# Altium schematic sheet Main_Board.SchDoc
size A4; SheetNumber: 1; SheetTotal: 4
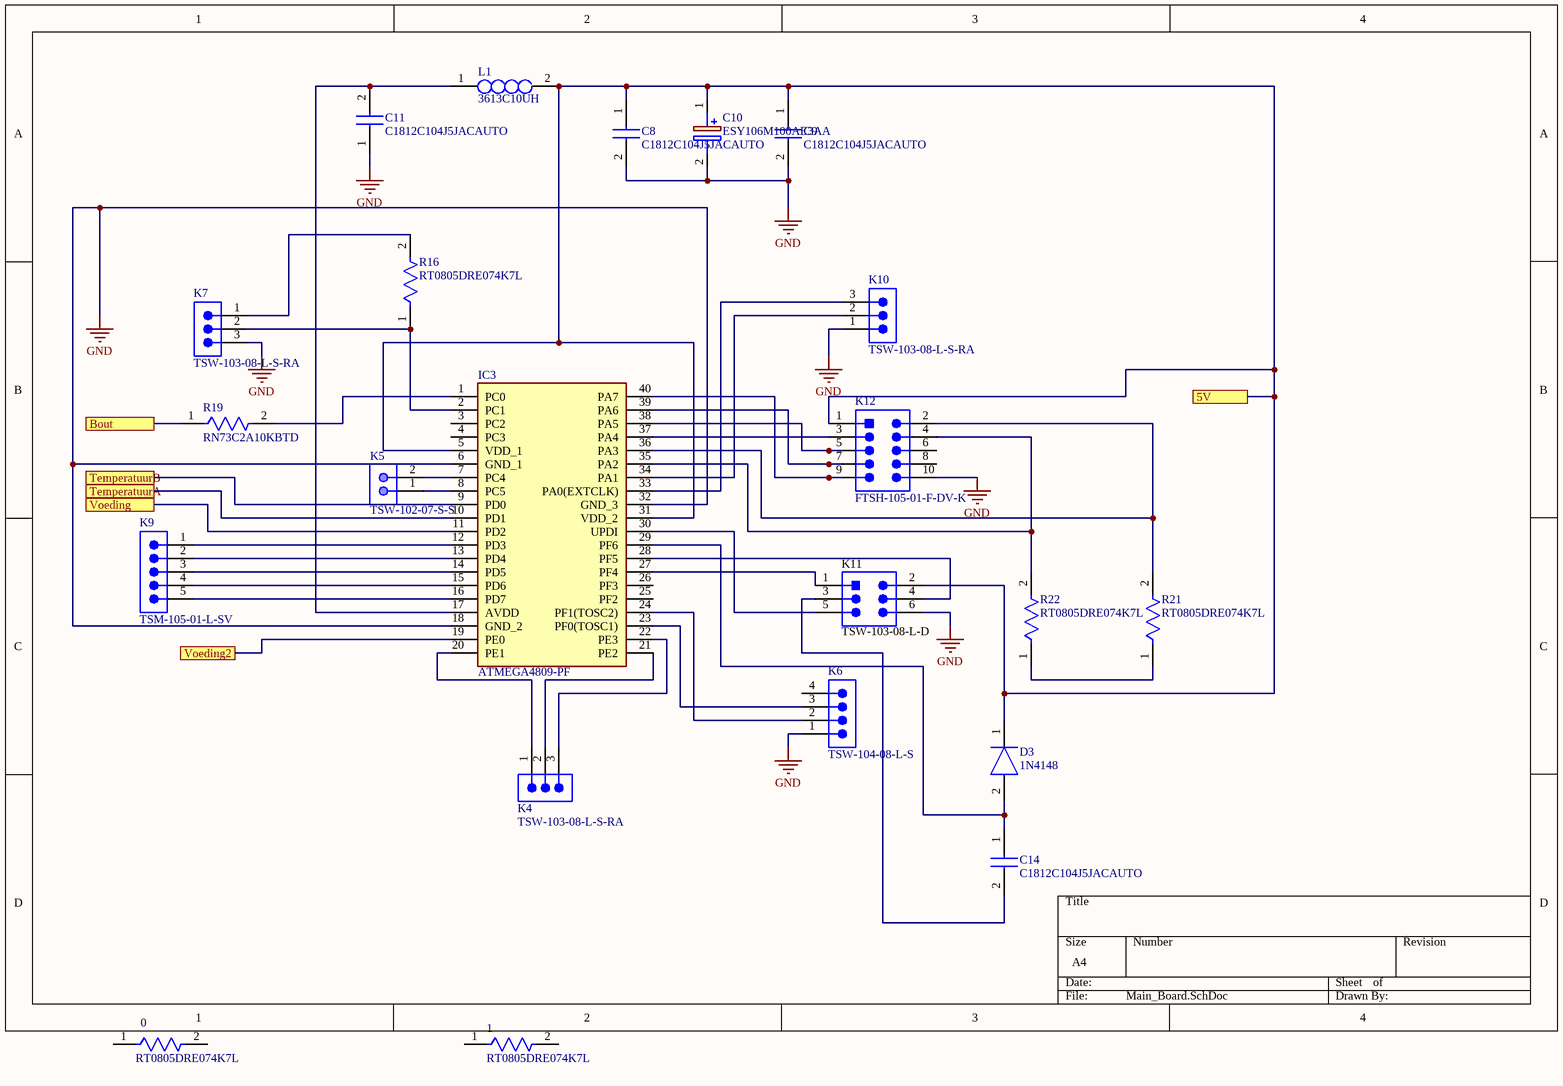
[diagram p0: Main_Board.SchDoc]

## Parts
0  RT0805DRE074K7L  [FP-RT0805-MFG]
1  RT0805DRE074K7L  [FP-RT0805-MFG]
C8  C1812C104J5JACAUTO  [CAPC4532X110N]
C9  C1812C104J5JACAUTO  [CAPC4532X110N]
C10  ESY106M100AE3AA  [CAPPRD250W50D630H1250]
C11  C1812C104J5JACAUTO  [CAPC4532X110N]
C14  C1812C104J5JACAUTO  [CAPC4532X110N]
D3  1N4148  [DIOAD1165W56L425D185]
IC3  ATMEGA4809-PF  [DIP1543W58P254L5175H635Q40N]
K4  TSW-103-08-L-S-RA  [SMTC-TSW-103-08-X-S-RA]
K5  TSW-102-07-S-S  [SMTC-TSW-102-07-S-S]
K6  TSW-104-08-L-S  [SMTC-TSW-104-08-X-S]
K7  TSW-103-08-L-S-RA  [SMTC-TSW-103-08-X-S-RA]
K9  TSM-105-01-L-SV  [SMTC-TSM-105-01-X-SV]
K10  TSW-103-08-L-S-RA  [SMTC-TSW-103-08-X-S-RA]
K11  TSW-103-08-L-D  [SMTC-TSW-103-08-L-D_V]
K12  FTSH-105-01-F-DV-K  [SMTC-FTSH-105-01-L-DV-K_V]
L1  3613C10UH  [INDM4532X340N]
R16  RT0805DRE074K7L  [FP-RT0805-MFG]
R19  RN73C2A10KBTD  [FP-RN732A-MFG]
R21  RT0805DRE074K7L  [FP-RT0805-MFG]
R22  RT0805DRE074K7L  [FP-RT0805-MFG]

## Ports
5V, Bout, TemperatuurA, TemperatuurB, Voeding, Voeding2

## Nets
GND: C8.2 C9.2 C10.2(-) C11.1 IC3.6(GND_1) IC3.18(GND_2) IC3.32(GND_3) K6.1 K7.3 K10.1 K11.6 K12.10
5V: C8.1 C9.1 C10.1(+) D3.1(K) IC3.5(VDD_1) IC3.31(VDD_2) K11.2 K12.1 L1.2 ; port 5V
Bout: R19.1 ; port Bout
TemperatuurA: IC3.10(PD1) ; port TemperatuurA
TemperatuurB: IC3.9(PD0) ; port TemperatuurB
Voeding: IC3.11(PD2) ; port Voeding
Voeding2: IC3.19(PE0) ; port Voeding2
NetC11_2: C11.2 IC3.17(AVDD) L1.1
NetC14_1: C14.1 D3.2(A) IC3.29(PF6)
NetC14_2: C14.2 K11.3
NetIC3_1: IC3.1(PC0) R19.2
NetIC3_2: IC3.2(PC1) K7.2 R16.1
NetIC3_7: IC3.7(PC4) K5.2
NetIC3_8: IC3.8(PC5) K5.1
NetIC3_12: IC3.12(PD3) K9.1
NetIC3_13: IC3.13(PD4) K9.2
NetIC3_14: IC3.14(PD5) K9.3
NetIC3_15: IC3.15(PD6) K9.4
NetIC3_16: IC3.16(PD7) K9.5
NetIC3_20: IC3.20(PE1) K4.1
NetIC3_21: IC3.21(PE2) K4.2
NetIC3_22: IC3.22(PE3) K4.3
NetIC3_23: IC3.23(PF0(TOSC1)) K6.3
NetIC3_24: IC3.24(PF1(TOSC2)) K6.2
NetIC3_27: IC3.27(PF4) K11.1
NetIC3_28: IC3.28(PF5) K11.4
NetIC3_30: IC3.30(UPDI) K11.5
NetIC3_33: IC3.33(PA0(EXTCLK)) K10.3
NetIC3_34: IC3.34(PA1) K10.2
NetIC3_35: IC3.35(PA2) K12.4 R22.2
NetIC3_36: IC3.36(PA3) K12.2 R21.2
NetIC3_37: IC3.37(PA4) K12.3
NetIC3_38: IC3.38(PA5) K12.5
NetIC3_39: IC3.39(PA6) K12.7
NetIC3_40: IC3.40(PA7) K12.9
NetK7_1: K7.1 R16.2
NetR21_1: R21.1 R22.1

Not connected (* = marked no-connect by the designer): 0 1 2; 1 1 2; IC3 3(PC2) 4(PC3) 25(PF2) 26(PF3); K6 4; K12 6 8

## Library data of the parts
0 1 R16 R21 R22 = CMP-03412-005354-1: RES SMD 4.7K OHM 0.5% 1/8W 0805; Manufacturer: Yageo; Value: 4.7KΩ; Power Rating: 0.125W; Tolerance: 0.01; Voltage Rating: 150V; Temperature Coefficient: 50 ppm/°C; Lead Free: Yes; Device Class L2: Resistors; ComponentLink2Description: Datasheet; RoHS: TRUE; Package: RT0805; Resistance: 4.7KΩ; Device Class L3: Chip SMD Resistors; Ipc Land Pattern Name: RESC200125X50; Category: Res; Octopart: https://octopart.com/rt0805dre074k7l-yageo-1242027; Temperature: -55°C to +155°C; Temperature Range High: +155°C; Digikey Description: RES SMD 4.7K OHM 0.5% 1/8W 0805; Series: RT; Height: 0.6mm; Footprint Url: http://www.yageo.com/exep/pages/download/literatures/PYu-R_Mount_10.pdf; Device Class L1: Passive Components; Temperature Range Low: -55°C; Composition: Thin Film; Manufacturer Part Number: RT0805DRE074K7L; ComponentLink2URL: http://www.yageo.com/documents/recent/PYu-RT_1-to-0.01_RoHS_L_9.pdf; Automotive: No
C8 C9 C11 C14 = C1812C104J5JACAUTO: Capacitor; Manufacturer_Name: Kemet; Datasheet Link: https://www.mouser.co.uk/ProductDetail/KEMET/C1812C104J5JACAUTO?qs=sGAEpiMZZMuMW9TJLBQkXk76meUxNvf1WfCyyeF%2F6yU%3D; Height: 1.1mm; Manufacturer_Part_Number: C1812C104J5JACAUTO
C10 = ESY106M100AE3AA: Capacitor Polarised; Manufacturer_Name: Kemet; Datasheet Link: https://connect.kemet.com:7667/gateway/IntelliData-ComponentDocumentation/1.0/download/specsheet/ESY106M100AE3AA; Height: 12.5mm; Manufacturer_Part_Number: ESY106M100AE3AA
D3 = 1N4148: Diode; Manufacturer_Name: Nexperia; Datasheet Link: https://datasheet.datasheetarchive.com/originals/distributors/Datasheets-112/DSAP0040891.pdf; Manufacturer_Part_Number: 1N4148
IC3 = ATMEGA4809-PF: Integrated Circuit; Manufacturer_Name: Microchip; Datasheet Link: https://componentsearchengine.com//ATMEGA4809-PF.pdf; Height: 6.35mm; Mouser2 Part Number: 556-ATMEGA4809-PF; Mouser2 Price/Stock: https://www.mouser.com/Search/Refine.aspx?Keyword=556-ATMEGA4809-PF; Manufacturer_Part_Number: ATMEGA4809-PF
K4 K7 K10 = CMP-1024-00343-1: 0.025" SQ Post Header, Through-hole, Right Angle, -55 to 125 degC, 2.54 mm Pitch, 3-Pin, Male, RoHS; Manufacturer: Samtec; Pitch: 2.54 mm; ComponentLink2Description: Datasheet; Temperature Range: -55 to 125 degC; ComponentLink1Description: Manufacturer URL; Mounting Technology: Through-hole; ComponentLink3URL: http://www.samtec.com/documents/webfiles/cpdf/TSW-XXX-XX-XXX-X-XX-XXX-MKT.pdf; DatasheetVersion: F-214; PackageDescription: .025[0.64] SQ. Post Terminal Strip Assembly; PackageVersion: DM, 8/1988; Orientation: Right Angle; PackageReference: TSW-103-08-X-S-RA; ComponentLink1URL: http://www.samtec.com; ComponentLink3Description: Package Specification; PartNumber: TSW-103-08-L-S-RA; RoHS: True; ComponentLink2URL: http://www.samtec.com/documents/webfiles/pdf/TSW_TH.PDF
K5 = CMP-1681-00004-4: Male Header, Pitch 2.54 mm, 1 x 2 Position, Height 8.38 mm, Tail Length 2.54 mm, -55 to 125 degC, RoHS, Bulk; Manufacturer: Samtec; Rows: 1; ComponentLink1URL: http://www.samtec.com/; Contact Finish: Gold; Mounting Technology: Through Hole; PackageReference: TSW-102-07-S-S; RoHSCompliant: true; Pins: 2; Contact Material: Bronze; ComponentLink2Description: Datasheet; Max Operating Temperature: 125 degC; Min Operating Temperature: -55 degC; Height: 8.38 mm; Packaging: Bulk; ComponentLink1Description: Manufacturer URL; PackageDescription: Male Header, Pitch 2.54 mm, 1 x 2 Position, Height 8.38 mm, Tail Length 2.54 mm; Colour: Black; Contact Plating: Gold; Length: 5.08 mm; ComponentLink2URL: http://suddendocs.samtec.com/catalog_english/tsw_th.pdf; DatasheetVersion: 12/2015; Mount: Through Hole; Lead Pitch: 0.1 inch; REACH SVHC: No SVHC; Package Quantity: 1
K6 = CMP-1024-00358-1: 0.025" SQ Post Header, Through-hole, Vertical, -55 to 125 degC, 2.54 mm Pitch, 4-Pin, Male, RoHS; Manufacturer: Samtec; Pitch: 2.54 mm; PartNumber: TSW-104-08-L-S; RoHS: True; Temperature Range: -55 to 125 degC; PackageDescription: .025[0.64] SQ. Post Terminal Strip Assembly; Orientation: Vertical; ComponentLink2URL: http://www.samtec.com/documents/webfiles/pdf/TSW_TH.PDF; ComponentLink1Description: Manufacturer URL; ComponentLink2Description: Datasheet; PackageVersion: DM, 8/1988; ComponentLink3URL: http://www.samtec.com/documents/webfiles/cpdf/TSW-XXX-XX-XXX-X-XX-XXX-MKT.pdf; Mounting Technology: Through-hole; PackageReference: TSW-104-08-X-S; ComponentLink3Description: Package Specification; ComponentLink1URL: http://www.samtec.com; DatasheetVersion: F-214
K9 = CMP-1024-00241-1: 0.025" SQ Post Header, Surface Mount, Vertical, -55 to 125 degC, 2.54 mm Pitch, 5-Pin, Male, RoHS; Manufacturer: Samtec; Pitch: 2.54 mm; Temperature Range: -55 to 125 degC; ComponentLink3Description: Package Specification; ComponentLink1Description: Manufacturer URL; RoHS: True; PackageDescription: Single Row .100 SMT Assembly; PackageReference: TSM-105-01-X-SV; PartNumber: TSM-105-01-L-SV; ComponentLink1URL: http://www.samtec.com; ComponentLink2URL: http://www.samtec.com/documents/webfiles/pdf/TSM.PDF; Orientation: Vertical; PackageVersion: BP, 8/2002; ComponentLink3URL: http://www.samtec.com/documents/webfiles/cpdf/TSM-1XX-XX-XXX-SV-XX-XXX-XX-MKT.pdf; ComponentLink2Description: Datasheet; DatasheetVersion: F-214; Mounting Technology: Surface Mount
K11 = CMP-1024-00336-5: Male Header, Pitch 2.54 mm, 2 x 3 Position, Height 8.38 mm, Tail Length 5.08 mm, -55 to 125 degC, RoHS, Bulk; Manufacturer: Samtec; DatasheetVersion: 04/2012; ComponentLink3URL: http://suddendocs.samtec.com/prints/tsw-xxx-xx-x-x-xx-xxx-footprint.pdf; PackageReference: TSW-103-08-L-D; Mounting Technology: Through Hole; Min Operating Temperature: -55 degC; ComponentLink2Description: Datasheet; Lead Pitch: 2.54 mm; ComponentLink1Description: Manufacturer URL; Mount: Through Hole; ComponentLink1URL: http://www.samtec.com/; ComponentLink3Description: Package Specification; Max Operating Temperature: 125 degC; PackageDescription: Male Header, Pitch 2.54 mm, 2 x 3 Position, Height 8.38 mm, Tail Length 5.08 mm; ComponentLink2URL: https://datasheet.ciiva.com/25618/0900766b81154476-25618436.pdf; RoHSCompliant: true
K12 = CMP-2000-05352-1: Male Header, Pitch 1.27 mm, 2 x 5 Position, Height 6.12 mm, RoHS, Tube; Manufacturer: Samtec; Number of Positions: 10; Connector Type: Header,Shrouded; Number of Positions Loaded: All; Row Spacing: 0.050"(1.27mm); Fastening Type: -; Package Reference: FTSH-105-01-L-DV-K; Termination: Solder; Package URL: http://suddendocs.samtec.com/prints/ftsh-1xx-xx-xxx-dv-xxx-footprint.pdf; Number of Rows: 2; Contact Finish Thickness: 3µin(0.08µm); Contact Type: MalePin; Manufacturer URL: http://www.samtec.com/; Contact Mating Length: 0.120"(3.05mm); Pitch: 0.050"(1.27mm); Series: FTSH; Features: -; Contact Finish: Gold; Color: Black; Family: RectangularConnectors-Headers,MalePins; Datasheet URL: http://suddendocs.samtec.com/prints/ftsh-1xx-xx-xxx-dv-xxx-mkt.pdf; Package Description: Male Header, Pitch 1.27 mm, 2 x 5 Position, Height 5.97 mm, Tail Length 4.32 mm; Mounting Type: SurfaceMount; Datasheet Version: Rev. ET, 10/1995; Category: Connectors,Interconnects; Packaging: Tube
L1 = 3613C10UH: Inductor; Manufacturer_Name: TE Connectivity; Datasheet Link: https://www.mouser.mx/datasheet/2/418/NG_CD_1624094_BB1-686728.pdf; Height: 3.4mm; Manufacturer_Part_Number: 3613C10UH
R19 = CMP-03211-006013-1: SMD Chip Resistor, Thin Film, 10KΩ, 100 V, 0805 [2012 Metric], 100 mW, 0.1%, RN73 Series; Manufacturer: TE Connectivity; Voltage Rating: 100V; Power Rating: 0.1W; Temperature Coefficient: 10ppm/°C; Value: 10KΩ; Lead Free: Yes; Temperature Range Low: -55°C; Temperature: -55°C to 155°C; RoHS: TRUE; Category: Res; Device Class L3: Chip SMD Resistors; Device Class L1: Passive Components; Resistance: 10KΩ; ComponentLink2URL: https://www.te.com/commerce/DocumentDelivery/DDEController?Action=showdoc&DocId=Data+Sheet%7F1773270%7FP%7Fpdf%7FEnglish%7FENG_DS_1773270_P.pdf%7F1676162-2; Device Class L2: Resistors; Ipc Land Pattern Name: RESC200125X55; Automotive: No; Temperature Range High: 155°C; Height: 0.65mm; octopart_url: https://octopart.com/rn73c2a10kbtd-te+connectivity-22737006; Package: RN732A; Composition: Thin Film; packaging: 5000 Reel; Series: RN73; Manufacturer Part Number: RN73C2A10KBTD; ComponentLink2Description: Datasheet; Octopart: https://octopart.com/rn73c2a10kbtd-te+connectivity-22737006; Tolerance: 0.1%